# Altium schematic sheet Main.SchDoc
size A
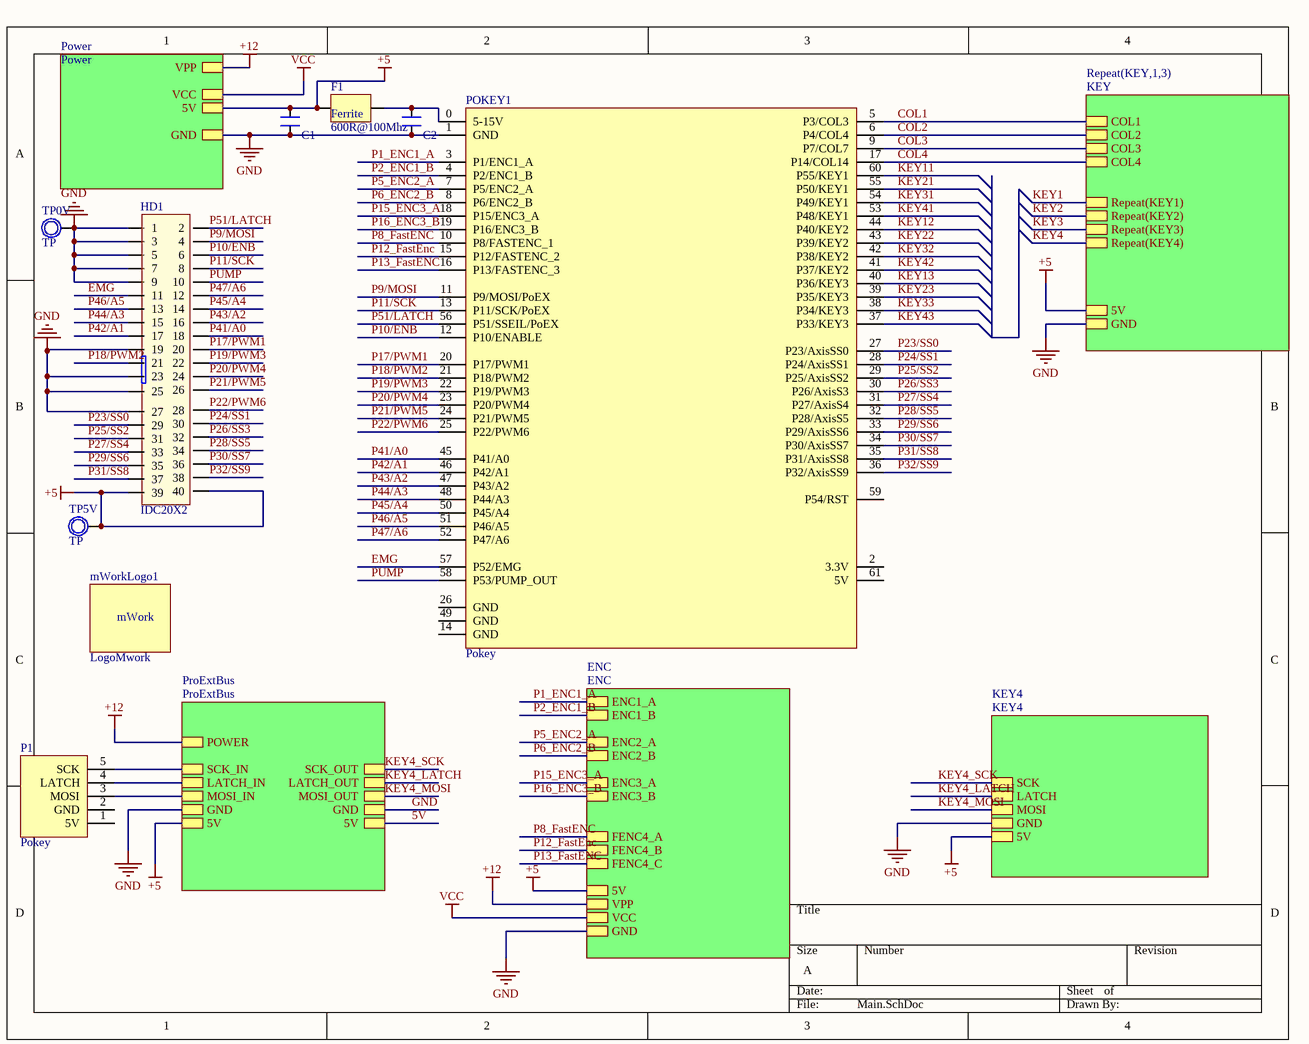
[diagram p0: Main.SchDoc]

## Parts
C1  CN  [CN-SMD-0603_big]  (value not drawn)
C2  CN  [CN-SMD-0603_big]  (value not drawn)
F1  600R@100Mhz  [Capacitor_805]
HD1  IDC20X2  [IDC40]
mWorkLogo1  LogoMwork  [LogoMwork30*12]
P1  Pokey  [JACK5]
POKEY1  Pokey  [POKEY]
TP0V  TP  [TP1]
TP5V  TP  [TP1]

## Sub-sheets
ENC = ENC: ENC1_A, ENC1_B, ENC2_A, ENC2_B, ENC3_A, ENC3_B, FENC4_A, FENC4_B, FENC4_C, VPP, VCC, GND, 5V
KEY4 = KEY4: SCK, LATCH, MOSI, GND, 5V
Power = Power: 5V, GND, VPP, VCC
ProExtBus = ProExtBus: SCK_IN, LATCH_IN, MOSI_IN, GND, 5V, SCK_OUT, LATCH_OUT, MOSI_OUT, GND, 5V, POWER
Repeat(KEY,1,3) = KEY: COL1, COL2, COL3, COL4, Repeat(KEY1), Repeat(KEY2), Repeat(KEY3), Repeat(KEY4), 5V, GND

## Nets
+5: C1.2 F1.1 HD1.39 HD1.40 TP5V.1 ; sheet Power/5V, sheet ProExtBus/5V, sheet ENC/5V, sheet Repeat(KEY,1,3)/5V, sheet KEY4/5V
+12: sheet Power/VPP, sheet ProExtBus/POWER, sheet ENC/VPP
GND: C1.1 C2.1 HD1.1 HD1.3 HD1.5 HD1.7 HD1.9 HD1.19 HD1.23 HD1.25 HD1.27 POKEY1.1(GND) TP0V.1 ; sheet Power/GND, sheet ProExtBus/GND, sheet ProExtBus/GND, sheet ENC/GND, sheet Repeat(KEY,1,3)/GND, sheet KEY4/GND
VCC: sheet Power/VCC, sheet ENC/VCC
5V: sheet ProExtBus/5V
COL1: POKEY1.5(P3/COL3) ; sheet Repeat(KEY,1,3)/COL1
COL2: POKEY1.6(P4/COL4) ; sheet Repeat(KEY,1,3)/COL2
COL3: POKEY1.9(P7/COL7) ; sheet Repeat(KEY,1,3)/COL3
COL4: POKEY1.17(P14/COL14) ; sheet Repeat(KEY,1,3)/COL4
EMG: HD1.11 POKEY1.57(P52/EMG)
KEY1: sheet Repeat(KEY,1,3)/Repeat(KEY1)
KEY2: sheet Repeat(KEY,1,3)/Repeat(KEY2)
KEY3: sheet Repeat(KEY,1,3)/Repeat(KEY3)
KEY4: sheet Repeat(KEY,1,3)/Repeat(KEY4)
KEY4_LATCH: sheet ProExtBus/LATCH_OUT, sheet KEY4/LATCH
KEY4_MOSI: sheet ProExtBus/MOSI_OUT, sheet KEY4/MOSI
KEY4_SCK: sheet ProExtBus/SCK_OUT, sheet KEY4/SCK
KEY11: POKEY1.60(P55/KEY1)
KEY12: POKEY1.44(P40/KEY2)
KEY13: POKEY1.40(P36/KEY3)
KEY21: POKEY1.55(P50/KEY1)
KEY22: POKEY1.43(P39/KEY2)
KEY23: POKEY1.39(P35/KEY3)
KEY31: POKEY1.54(P49/KEY1)
KEY32: POKEY1.42(P38/KEY2)
KEY33: POKEY1.38(P34/KEY3)
KEY41: POKEY1.53(P48/KEY1)
KEY42: POKEY1.41(P37/KEY2)
KEY43: POKEY1.37(P33/KEY3)
P1_ENC1_A: POKEY1.3(P1/ENC1_A) ; sheet ENC/ENC1_A
P2_ENC1_B: POKEY1.4(P2/ENC1_B) ; sheet ENC/ENC1_B
P5_ENC2_A: POKEY1.7(P5/ENC2_A) ; sheet ENC/ENC2_A
P6_ENC2_B: POKEY1.8(P6/ENC2_B) ; sheet ENC/ENC2_B
P8_FastENC: POKEY1.10(P8/FASTENC_1) ; sheet ENC/FENC4_A
P9/MOSI: HD1.4 POKEY1.11(P9/MOSI/PoEX)
P10/ENB: HD1.6 POKEY1.12(P10/ENABLE)
P11/SCK: HD1.8 POKEY1.13(P11/SCK/PoEX)
P12_FastEnc: POKEY1.15(P12/FASTENC_2) ; sheet ENC/FENC4_B
P13_FastENC: POKEY1.16(P13/FASTENC_3) ; sheet ENC/FENC4_C
P15_ENC3_A: POKEY1.18(P15/ENC3_A) ; sheet ENC/ENC3_A
P16_ENC3_B: POKEY1.19(P16/ENC3_B) ; sheet ENC/ENC3_B
P17/PWM1: HD1.20 POKEY1.20(P17/PWM1)
P18/PWM2: HD1.21 POKEY1.21(P18/PWM2)
P19/PWM3: HD1.22 POKEY1.22(P19/PWM3)
P20/PWM4: HD1.24 POKEY1.23(P20/PWM4)
P21/PWM5: HD1.26 POKEY1.24(P21/PWM5)
P22/PWM6: HD1.28 POKEY1.25(P22/PWM6)
P23/SS0: HD1.29 POKEY1.27(P23/AxisSS0)
P24/SS1: HD1.30 POKEY1.28(P24/AxisSS1)
P25/SS2: HD1.31 POKEY1.29(P25/AxisSS2)
P26/SS3: HD1.32 POKEY1.30(P26/AxisS3)
P27/SS4: HD1.33 POKEY1.31(P27/AxisS4)
P28/SS5: HD1.34 POKEY1.32(P28/AxisS5)
P29/SS6: HD1.35 POKEY1.33(P29/AxisSS6)
P30/SS7: HD1.36 POKEY1.34(P30/AxisSS7)
P31/SS8: HD1.37 POKEY1.35(P31/AxisSS8)
P32/SS9: HD1.38 POKEY1.36(P32/AxisSS9)
P41/A0: HD1.18 POKEY1.45(P41/A0)
P42/A1: HD1.17 POKEY1.46(P42/A1)
P43/A2: HD1.16 POKEY1.47(P43/A2)
P44/A3: HD1.15 POKEY1.48(P44/A3)
P45/A4: HD1.14 POKEY1.50(P45/A4)
P46/A5: HD1.13 POKEY1.51(P46/A5)
P47/A6: HD1.12 POKEY1.52(P47/A6)
P51/LATCH: HD1.2 POKEY1.56(P51/SSEIL/PoEX)
PUMP: HD1.10 POKEY1.58(P53/PUMP_OUT)
NetC2_2: C2.2 F1.2 POKEY1.0(5-15V)
NetP1_3: P1.3(MOSI) ; sheet ProExtBus/MOSI_IN
NetP1_4: P1.4(LATCH) ; sheet ProExtBus/LATCH_IN
NetP1_5: P1.5(SCK) ; sheet ProExtBus/SCK_IN

Not connected (* = marked no-connect by the designer): P1 1(5V) 2(GND); POKEY1 2(3.3V) 14(GND) 26(GND) 49(GND) 59(P54/RST) 61(5V)

## Notes on the sheet
- (in symbol LogoMwork) mWork

## Library data of the parts
C1 C2 = CN: Value: 33pF
F1 = Ferrite
HD1 = IDC20X2: IDC 13x2; Value: Header 5x2
P1 = Pokey_Jack
TP0V TP5V = TP1: Test Point; Value: Test Point